# EAGLE design ROV_HAT_sceem (EAGLE 9.2.2)
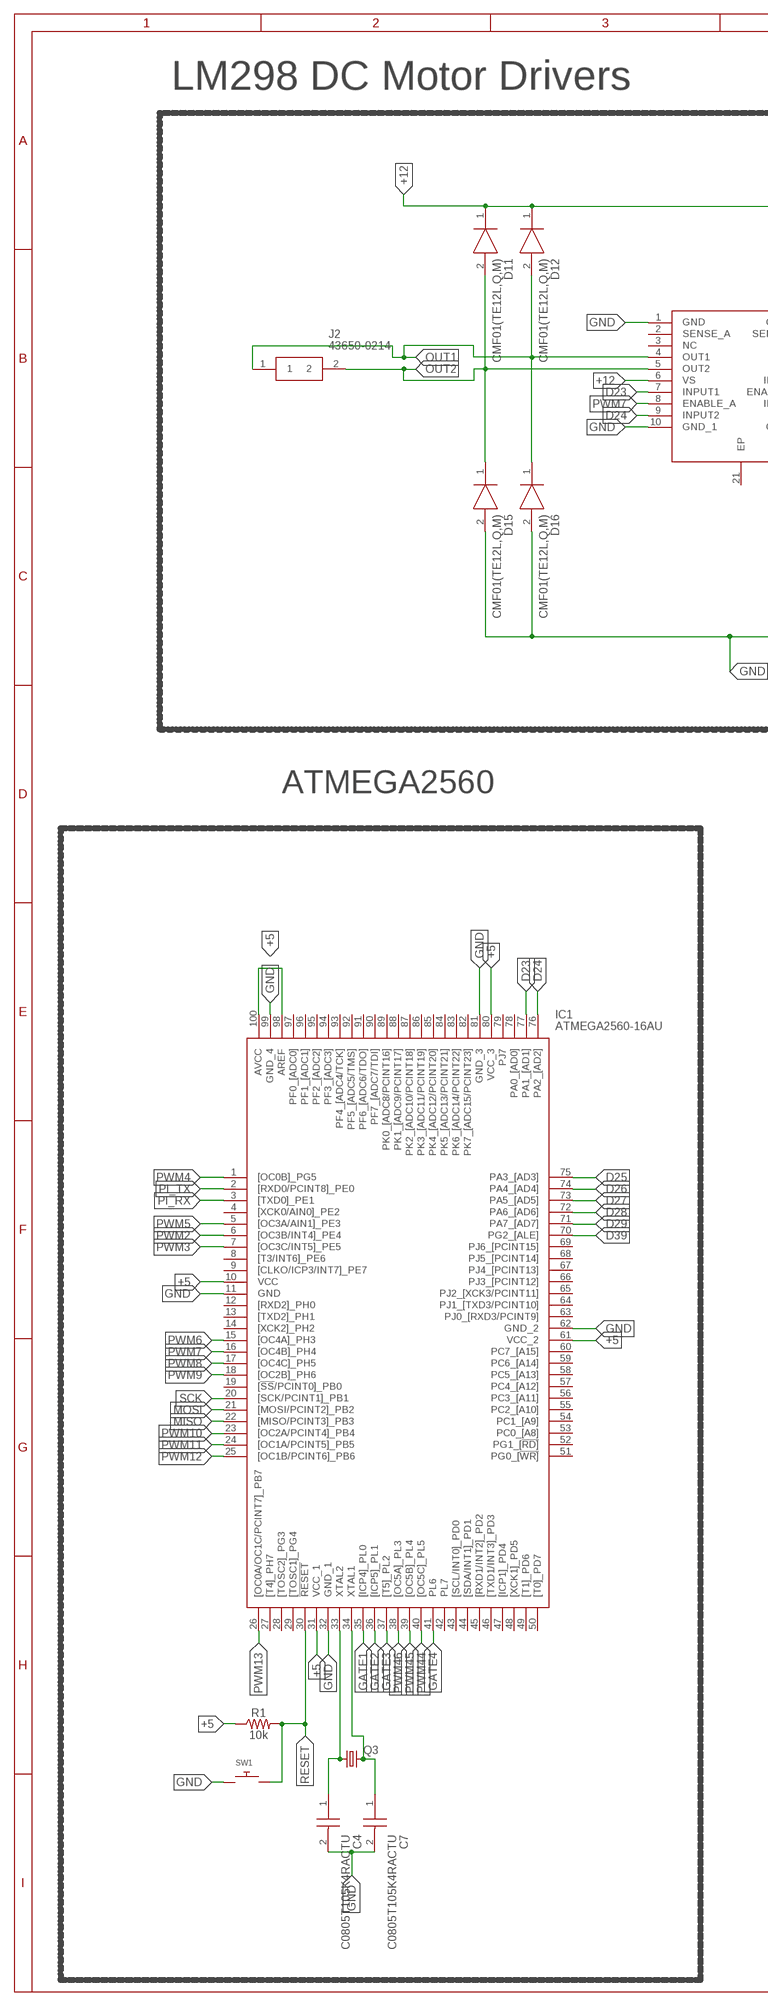
[diagram p0: schematic, sheet 1, part 1 of 2]
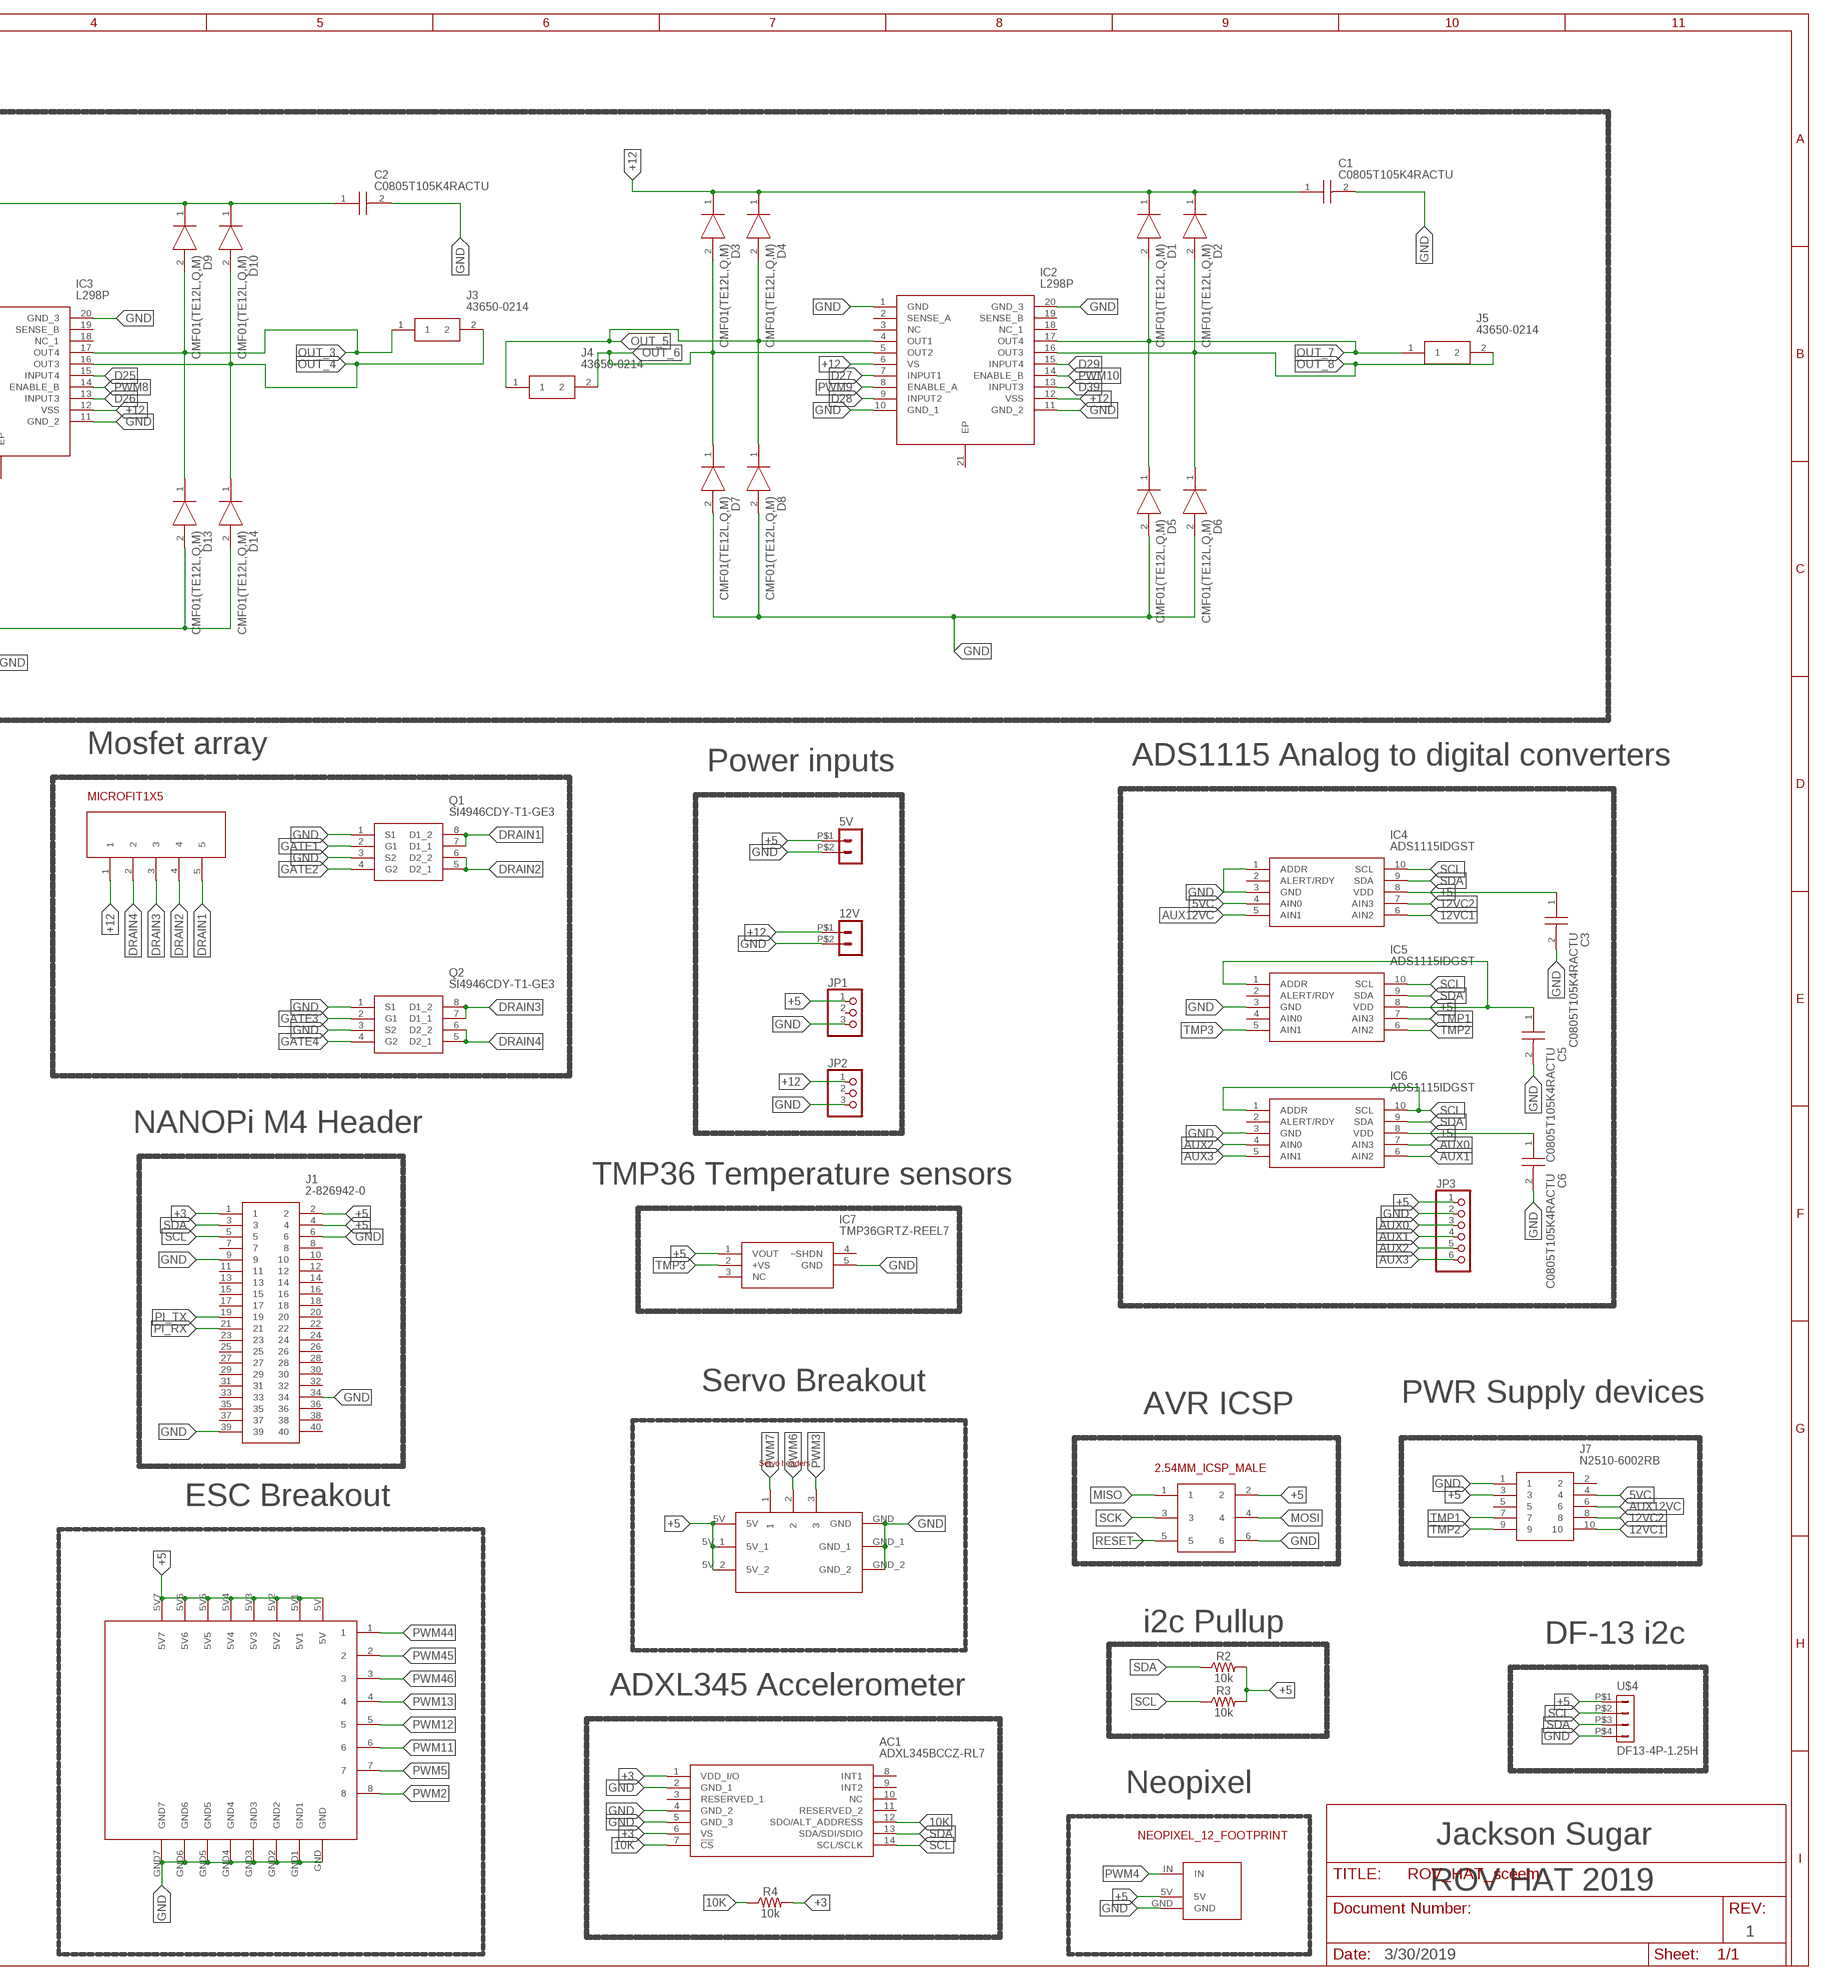
[diagram p1: schematic, sheet 1, part 2 of 2]

## Parts
5V  HEADER_POS2_43045-0200  [43045-0200]
12V  HEADER_POS2_43650-0200  [43650-0200]
AC1  ADXL345BCCZ-RL7  [CC-14-1]
C1  C0805T105K4RACTU  [CAPC2012X100N]
C2  C0805T105K4RACTU  [CAPC2012X100N]
C3  C0805T105K4RACTU  [CAPC2012X100N]
C4  C0805T105K4RACTU  [CAPC2012X100N]
C5  C0805T105K4RACTU  [CAPC2012X100N]
C6  C0805T105K4RACTU  [CAPC2012X100N]
C7  C0805T105K4RACTU  [CAPC2012X100N]
D1  CMF01(TE12L,Q,M)  [SODFL4724X108N]
D2  CMF01(TE12L,Q,M)  [SODFL4724X108N]
D3  CMF01(TE12L,Q,M)  [SODFL4724X108N]
D4  CMF01(TE12L,Q,M)  [SODFL4724X108N]
D5  CMF01(TE12L,Q,M)  [SODFL4724X108N]
D6  CMF01(TE12L,Q,M)  [SODFL4724X108N]
D7  CMF01(TE12L,Q,M)  [SODFL4724X108N]
D8  CMF01(TE12L,Q,M)  [SODFL4724X108N]
D9  CMF01(TE12L,Q,M)  [SODFL4724X108N]
D10  CMF01(TE12L,Q,M)  [SODFL4724X108N]
D11  CMF01(TE12L,Q,M)  [SODFL4724X108N]
D12  CMF01(TE12L,Q,M)  [SODFL4724X108N]
D13  CMF01(TE12L,Q,M)  [SODFL4724X108N]
D14  CMF01(TE12L,Q,M)  [SODFL4724X108N]
D15  CMF01(TE12L,Q,M)  [SODFL4724X108N]
D16  CMF01(TE12L,Q,M)  [SODFL4724X108N]
IC1  ATMEGA2560-16AU  [QFP50P1600X1600X120-100N]
IC2  L298P  [SOIC127P1420X360-21N]
IC3  L298P  [SOIC127P1420X360-21N]
IC4  ADS1115IDGST  [SOP50P490X110-10N]
IC5  ADS1115IDGST  [SOP50P490X110-10N]
IC6  ADS1115IDGST  [SOP50P490X110-10N]
IC7  TMP36GRTZ-REEL7  [SOT95P280X145-5N]
J1  2-826942-0  [HDRV40W63P254_2X20_5080X500X88]
J2  43650-0214  [43650-0214]
J3  43650-0214  [43650-0214]
J4  43650-0214  [43650-0214]
J5  43650-0214  [43650-0214]
J7  N2510-6002RB  [SHDR10W64P254_2X5_2002X859X100]
JP1  PINHD-1X3  [1X03]
JP2  PINHD-1X3  [1X03]
JP3  PINHD-1X6  [1X06]
Q1  SI4946CDY-T1-GE3  [SOIC127P600X175-8N]
Q2  SI4946CDY-T1-GE3  [SOIC127P600X175-8N]
Q3  CRYSTALHC49S  [HC49/S]
R1  10k  10KOHM-0603-1/10W-1%  [0603]
R2  10k  10KOHM-0603-1/10W-1%  [0603]
R3  10k  10KOHM-0603-1/10W-1%  [0603]
R4  10k  10KOHM-0603-1/10W-1%  [0603]
SW1  SWITCH_PUSHBUTTONC&K_KSS  [BTN_CK_KSS]
U$1  3X8_RIGHT_HEADER  [3X8_RIGHT_HEADER]
U$2  2.54MM_ICSP_MALE  [2.54MM_ICSP_MALE]
U$3  NEOPIXEL_12_FOOTPRINT  [NEOPIXEL_12_FOOTPRINT]
U$4  DF13-4P-1.25H  [DF13A-4P-1.25H]
U$5  SERVO_PWM_HEADER  [SERVO_PWM_HEADER]
U$6  MICROFIT1X5  [MICROFIT1X5]

## Nets
5VC: IC4.4(AIN0) J7.4
10K: AC1.7(!CS) AC1.12(SDO/ALT_ADDRESS) R4.1
12VC1: IC4.6(AIN2) J7.10
12VC2: IC4.7(AIN3) J7.8
+3: AC1.1(VDD_I/O) AC1.6(VS) J1.1 R4.2
+5: 5V.P$1 C3.1 C5.1 C6.1 IC1.10(VCC) IC1.31(VCC_1) IC1.61(VCC_2) IC1.80(VCC_3) IC1.98(AREF) IC1.100(AVCC) IC4.8(VDD) IC5.1(ADDR) IC5.8(VDD) IC6.8(VDD) IC7.1(VOUT) J1.2 J1.4 J7.3 JP1.1 JP3.1 R1.1 R2.2 R3.2 U$1.5V U$1.5V1 U$1.5V2 U$1.5V3 U$1.5V4 U$1.5V5 U$1.5V6 U$1.5V7 U$2.2 U$3.5V U$4.P$1 U$5.5V U$5.5V_1 U$5.5V_2
+12: 12V.P$1 C1.1 C2.1 D1.1(K) D2.1(K) D3.1(K) D4.1(K) D9.1(K) D10.1(K) D11.1(K) D12.1(K) IC2.6(VS) IC2.12(VSS) IC3.6(VS) IC3.12(VSS) JP2.1 U$6.1
AUX0: IC6.7(AIN3) JP3.3
AUX1: IC6.6(AIN2) JP3.4
AUX2: IC6.4(AIN0) JP3.5
AUX3: IC6.5(AIN1) JP3.6
AUX12VC: IC4.5(AIN1) J7.6
D23: IC1.77(PA1_[AD1]) IC3.7(INPUT1)
D24: IC1.76(PA2_[AD2]) IC3.9(INPUT2)
D25: IC1.75(PA3_[AD3]) IC3.15(INPUT4)
D26: IC1.74(PA4_[AD4]) IC3.13(INPUT3)
D27: IC1.73(PA5_[AD5]) IC2.7(INPUT1)
D28: IC1.72(PA6_[AD6]) IC2.9(INPUT2)
D29: IC1.71(PA7_[AD7]) IC2.15(INPUT4)
D39: IC1.70(PG2_[ALE]) IC2.13(INPUT3)
DRAIN1: Q1.7(D1_1) Q1.8(D1_2) U$6.5
DRAIN2: Q1.5(D2_1) Q1.6(D2_2) U$6.4
DRAIN3: Q2.7(D1_1) Q2.8(D1_2) U$6.3
DRAIN4: Q2.5(D2_1) Q2.6(D2_2) U$6.2
GATE1: IC1.35([ICP4]_PL0) Q1.2(G1)
GATE2: IC1.36([ICP5]_PL1) Q1.4(G2)
GATE3: IC1.37([T5]_PL2) Q2.2(G1)
GATE4: IC1.41(PL6) Q2.4(G2)
GND: 5V.P$2 12V.P$2 AC1.2(GND_1) AC1.4(GND_2) AC1.5(GND_3) C1.2 C2.2 C3.2 C4.2 C5.2 C6.2 C7.2 D5.2(A) D6.2(A) D7.2(A) D8.2(A) D13.2(A) D14.2(A) D15.2(A) D16.2(A) IC1.11(GND) IC1.32(GND_1) IC1.62(GND_2) IC1.81(GND_3) IC1.99(GND_4) IC2.1(GND) IC2.10(GND_1) IC2.11(GND_2) IC2.20(GND_3) IC3.1(GND) IC3.10(GND_1) IC3.11(GND_2) IC3.20(GND_3) IC4.1(ADDR) IC4.3(GND) IC5.3(GND) IC6.3(GND) IC7.5(GND) J1.6 J1.9 J1.34 J1.39 J7.1 JP1.3 JP2.3 JP3.2 Q1.1(S1) Q1.3(S2) Q2.1(S1) Q2.3(S2) SW1.P$1 U$1.GND U$1.GND1 U$1.GND2 U$1.GND3 U$1.GND4 U$1.GND5 U$1.GND6 U$1.GND7 U$2.6 U$3.GND U$4.P$4 U$5.GND U$5.GND_1 U$5.GND_2
MISO: IC1.22([MISO/PCINT3]_PB3) U$2.1
MOSI: IC1.21([MOSI/PCINT2]_PB2) U$2.4
N$1: C4.1 IC1.33(XTAL2) Q3.1
N$2: C7.1 IC1.34(XTAL1) Q3.2
OUT1: D12.2(A) D16.1(K) IC3.4(OUT1) J2.1
OUT2: D11.2(A) D15.1(K) IC3.5(OUT2) J2.2
OUT_3: D9.2(A) D13.1(K) IC3.17(OUT4) J3.1
OUT_4: D10.2(A) D14.1(K) IC3.16(OUT3) J3.2
OUT_5: D4.2(A) D8.1(K) IC2.4(OUT1) J4.1
OUT_6: D3.2(A) D7.1(K) IC2.5(OUT2) J4.2
OUT_7: D1.2(A) D5.1(K) IC2.17(OUT4) J5.1
OUT_8: D2.2(A) D6.1(K) IC2.16(OUT3) J5.2
PI_RX: IC1.3([TXD0]_PE1) J1.21
PI_TX: IC1.2([RXD0/PCINT8]_PE0) J1.19
PWM2: IC1.6([OC3B/INT4]_PE4) U$1.8
PWM3: IC1.7([OC3C/INT5]_PE5) U$5.3
PWM4: IC1.1([OC0B]_PG5) U$3.IN
PWM5: IC1.5([OC3A/AIN1]_PE3) U$1.7
PWM6: IC1.15([OC4A]_PH3) U$5.2
PWM7: IC1.16([OC4B]_PH4) IC3.8(ENABLE_A) U$5.1
PWM8: IC1.17([OC4C]_PH5) IC3.14(ENABLE_B)
PWM9: IC1.18([OC2B]_PH6) IC2.8(ENABLE_A)
PWM10: IC1.23([OC2A/PCINT4]_PB4) IC2.14(ENABLE_B)
PWM11: IC1.24([OC1A/PCINT5]_PB5) U$1.6
PWM12: IC1.25([OC1B/PCINT6]_PB6) U$1.5
PWM13: IC1.26([OC0A/OC1C/PCINT7]_PB7) U$1.4
PWM44: IC1.40([OC5C]_PL5) U$1.1
PWM45: IC1.39([OC5B]_PL4) U$1.2
PWM46: IC1.38([OC5A]_PL3) U$1.3
RESET: IC1.30(!RESET) R1.2 SW1.P$2 U$2.5
SCK: IC1.20([SCK/PCINT1]_PB1) U$2.3
SCL: AC1.14(SCL/SCLK) IC4.10(SCL) IC5.10(SCL) IC6.1(ADDR) IC6.10(SCL) J1.5 R3.1 U$4.P$2
SDA: AC1.13(SDA/SDI/SDIO) IC4.9(SDA) IC5.9(SDA) IC6.9(SDA) J1.3 R2.1 U$4.P$3
TMP1: IC5.7(AIN3) J7.7
TMP2: IC5.6(AIN2) J7.9
TMP3: IC5.5(AIN1) IC7.2(+VS)
Unconnected: AC1.3(RESERVED_1) AC1.8(INT1) AC1.9(INT2) AC1.10(NC) AC1.11(RESERVED_2) IC1.4([XCK0/AIN0]_PE2) IC1.8([T3/INT6]_PE6) IC1.9([CLKO/ICP3/INT7]_PE7) IC1.12([RXD2]_PH0) IC1.13([TXD2]_PH1) IC1.14([XCK2]_PH2) IC1.19([!SS!/PCINT0]_PB0) IC1.27([T4]_PH7) IC1.28([TOSC2]_PG3) IC1.29([TOSC1]_PG4) IC1.42(PL7) IC1.43([SCL/INT0]_PD0) IC1.44([SDA/INT1]_PD1) IC1.45([RXD1/INT2]_PD2) IC1.46([TXD1/INT3]_PD3) IC1.47([ICP1]_PD4) IC1.48([XCK1]_PD5) IC1.49([T1]_PD6) IC1.50([T0]_PD7) IC1.51(PG0_[!WR]) IC1.52(PG1_[!RD]) IC1.53(PC0_[A8]) IC1.54(PC1_[A9]) IC1.55(PC2_[A10]) IC1.56(PC3_[A11]) IC1.57(PC4_[A12]) IC1.58(PC5_[A13]) IC1.59(PC6_[A14]) IC1.60(PC7_[A15]) IC1.63(PJ0_[RXD3/PCINT9]) IC1.64(PJ1_[TXD3/PCINT10]) IC1.65(PJ2_[XCK3/PCINT11]) IC1.66(PJ3_[PCINT12]) IC1.67(PJ4_[PCINT13]) IC1.68(PJ5_[PCINT14]) IC1.69(PJ6_[PCINT15]) IC1.78(PA0_[AD0]) IC1.79(PJ7) IC1.82(PK7_[ADC15/PCINT23]) IC1.83(PK6_[ADC14/PCINT22]) IC1.84(PK5_[ADC13/PCINT21]) IC1.85(PK4_[ADC12/PCINT20]) IC1.86(PK3_[ADC11/PCINT19]) IC1.87(PK2_[ADC10/PCINT18]) IC1.88(PK1_[ADC9/PCINT17]) IC1.89(PK0_[ADC8/PCINT16]) IC1.90(PF7_[ADC7/TDI]) IC1.91(PF6_[ADC6/TDO]) IC1.92(PF5_[ADC5/TMS]) IC1.93(PF4_[ADC4/TCK]) IC1.94(PF3_[ADC3]) IC1.95(PF2_[ADC2]) IC1.96(PF1_[ADC1]) IC1.97(PF0_[ADC0]) IC2.2(SENSE_A) IC2.3(NC) IC2.18(NC_1) IC2.19(SENSE_B) IC2.21(EP) IC3.2(SENSE_A) IC3.3(NC) IC3.18(NC_1) IC3.19(SENSE_B) IC3.21(EP) IC4.2(ALERT/RDY) IC5.2(ALERT/RDY) IC5.4(AIN0) IC6.2(ALERT/RDY) IC7.3(NC) IC7.4(~SHDN) J1.7 J1.8 J1.10 J1.11 J1.12 J1.13 J1.14 J1.15 J1.16 J1.17 J1.18 J1.20 J1.22 J1.23 J1.24 J1.25 J1.26 J1.27 J1.28 J1.29 J1.30 J1.31 J1.32 J1.33 J1.35 J1.36 J1.37 J1.38 J1.40 J7.2 J7.5 JP1.2 JP2.2

## Notes on the sheet
- LM298 DC Motor Drivers
- Mosfet array
- Power inputs | ADS1115 Analog to digital converters
- ATMEGA2560
- NANOPi M4 Header
- TMP36 Temperature sensors
- Servo Breakout
- PWR Supply devices
- AVR ICSP
- ESC Breakout
- i2c Pullup
- DF-13 i2c
- ADXL345 Accelerometer
- Neopixel
- Jackson Sugar
- ROV HAT 2019
- 1
- 3/30/2019

## Library data of the parts
5V 12V = con-molex-micro-fit-3_0:HEADER_POS2_?: Molex - Micro-Fit 3.0 Series connector, 3.00mm (0.118") pitch header, 2 positions.
AC1 = SamacSys_Parts:ADXL345BCCZ-RL7: ADXL345BCCZ-RL7 Analog Devices, 3-Axis Accelerometer, I2C, SPI, 14-Pin LGA Source: Datasheet <https://componentsearchengine.com/Datasheets/1/ADXL345BCCZ-RL7.pdf>; DESCRIPTION: ADXL345BCCZ-RL7 Analog Devices, 3-Axis Accelerometer, I2C, SPI, 14-Pin LGA; HEIGHT: mm; MANUFACTURER_NAME: Analog Devices; MANUFACTURER_PART_NUMBER: ADXL345BCCZ-RL7; MOUSER_PART_NUMBER: 584-ADXL345BCCZ-R7
C1-C7 = SamacSys_Parts:C0805T105K4RACTU: KEMET - C0805T105K4RACTU - CAP, 1F, 16V, 10%, X7R, 0805 Source: Datasheet <https://componentsearchengine.com/Datasheets/1/C0805T105K4RACTU.pdf>; DESCRIPTION: KEMET - C0805T105K4RACTU - CAP, 1F, 16V, 10%, X7R, 0805; HEIGHT: 1mm; MANUFACTURER_NAME: Kemet; MANUFACTURER_PART_NUMBER: C0805T105K4RACTU; MOUSER_PART_NUMBER: 80-C0805T105K4RACTU
D1-D16 = SamacSys_Parts:CMF01(TE12L,Q,M): Diodes - General Purpose, Power, Switching 600V 2A M-FLAT Source: Datasheet <https://componentsearchengine.com/Datasheets/1/CMF01(TE12L,Q,M).pdf>; DESCRIPTION: Diodes - General Purpose, Power, Switching 600V 2A M-FLAT; HEIGHT: 1.08mm; MANUFACTURER_NAME: Toshiba; MANUFACTURER_PART_NUMBER: CMF01(TE12L,Q,M); MOUSER_PART_NUMBER: 757-CMF01TE12LQM
IC1 = SamacSys_Parts:ATMEGA2560-16AU: ATMEGA2560-16AU, 8 bit AVR Microcontroller 16MHz 4, 256kb Flash, 8kb RAM, I2C SPI 100-Pin TQFP Source: Datasheet <https://componentsearchengine.com/Datasheets/1/ATMEGA2560-16AU.pdf>; DESCRIPTION: ATMEGA2560-16AU, 8 bit AVR Microcontroller 16MHz 4, 256kb Flash, 8kb RAM, I2C SPI 100-Pin TQFP; HEIGHT: 1.2mm; MANUFACTURER_NAME: Microchip; MANUFACTURER_PART_NUMBER: ATMEGA2560-16AU; MOUSER_PART_NUMBER: 556-ATMEGA2560-16AU
IC2 IC3 = SamacSys_Parts:L298P: L298P, Full Bridge Motor Driver, 3A Dual Full Bridge Motor Driver,, 25W 4.8 46 V, 20-Pin Power SO Source: Datasheet <http://www.mouser.com/datasheet/2/389/l298-954744.pdf>; DESCRIPTION: L298P, Full Bridge Motor Driver, 3A Dual Full Bridge Motor Driver,, 25W 4.8 46 V, 20-Pin Power SO; HEIGHT: 3.6mm; MANUFACTURER_NAME: STMicroelectronics; MANUFACTURER_PART_NUMBER: L298P; MOUSER_PART_NUMBER: 511-L298P
IC4-IC6 = SamacSys_Parts:ADS1115IDGST: 16-Bit, 860SPS, 4-Ch Delta-Sigma ADC w/ PGA, Oscillator, Voltage Reference, Comparator & I2C Source: Datasheet; DESCRIPTION: 16-Bit, 860SPS, 4-Ch Delta-Sigma ADC w/ PGA, Oscillator, Voltage Reference, Comparator & I2C; HEIGHT: 1.1mm; MANUFACTURER_NAME: Texas Instruments; MANUFACTURER_PART_NUMBER: ADS1115IDGST; MOUSER_PART_NUMBER: 595-ADS1115IDGST
IC7 = SamacSys_Parts:TMP36GRTZ-REEL7: Analog Devices TMP36GRTZ-REEL7 Temperature Sensor 5-Pin SOT-23, -40 +125 C Source: Datasheet <https://componentsearchengine.com/Datasheets/1/TMP36GRTZ-REEL7.pdf>; DESCRIPTION: Analog Devices TMP36GRTZ-REEL7 Temperature Sensor 5-Pin SOT-23, -40 +125 C; HEIGHT: mm; MANUFACTURER_NAME: Analog Devices; MANUFACTURER_PART_NUMBER: TMP36GRTZ-REEL7; MOUSER_PART_NUMBER: 584-TMP36GRTZ-R7
J1 = SamacSys_Parts:2-826942-0: 2x20 straight pin header tin Mod II Source: Datasheet <https://componentsearchengine.com/Datasheets/1/2-826942-0.pdf>; DESCRIPTION: 2x20 straight pin header tin Mod II; HEIGHT: 8.8mm; MANUFACTURER_NAME: TE Connectivity; MANUFACTURER_PART_NUMBER: 2-826942-0; MOUSER_PART_NUMBER: 571-2-826942-0
J2-J5 = SamacSys_Parts:43650-0214: Molex MICRO-FIT 3.0 Series, Series Number 43650, 3mm Pitch 2 Way 1 Row Right Angle PCB Header, Solder Termination, 5A Source: Datasheet <http://www.mouser.com/datasheet/2/276/0436500214_PCB_HEADERS-693580.pdf>; DESCRIPTION: Molex MICRO-FIT 3.0 Series, Series Number 43650, 3mm Pitch 2 Way 1 Row Right Angle PCB Header, Solder Termination, 5A; HEIGHT: mm; MANUFACTURER_NAME: Molex; MANUFACTURER_PART_NUMBER: 43650-0214; MOUSER_PART_NUMBER: 538-43650-0214
J7 = SamacSys_Parts:N2510-6002RB: 3M 10W ST BOX HDR CLASS 2 3M 2500 Series, 2.54mm Pitch 10 Way 2 Row Straight PCB Header, Solder Termination, 2A Source: Datasheet <https://componentsearchengine.com/Datasheets/1/N2510-6002RB.pdf>; DESCRIPTION: 3M 10W ST BOX HDR CLASS 2 3M 2500 Series, 2.54mm Pitch 10 Way 2 Row Straight PCB Header, Solder Termination, 2A; HEIGHT: 10.04mm; MANUFACTURER_NAME: 3M; MANUFACTURER_PART_NUMBER: N2510-6002RB; MOUSER_PART_NUMBER: 517-N2510-6002RB
JP1 JP2 = adafruit:PINHD-1X3: PIN HEADER
JP3 = adafruit:PINHD-1X6: PIN HEADER
Q1 Q2 = SamacSys_Parts:SI4946CDY-T1-GE3: VISHAY - SI4946CDY-T1-GE3 - MOSFET, DUAL N-CH, 60V, SOIC Source: Datasheet <https://componentsearchengine.com/Datasheets/1/SI4946CDY-T1-GE3.pdf>; DESCRIPTION: VISHAY - SI4946CDY-T1-GE3 - MOSFET, DUAL N-CH, 60V, SOIC; HEIGHT: 1.75mm; MANUFACTURER_NAME: Vishay; MANUFACTURER_PART_NUMBER: SI4946CDY-T1-GE3; MOUSER_PART_NUMBER: 78-SI4946CDY-T1-GE3
Q3 = adafruit:CRYSTAL: CRYSTAL; OC_FARNELL: 1667008; OC_NEWARK: unknown
R1-R4 = SparkFun-Resistors:10KOHM: 10kΩ resistor A resistor is a passive two-terminal electrical component that implements electrical resistance as a circuit element. Resistors act to reduce current flow, and, at the same time, act to lower voltage levels within circuits. - Wikipedia; PROD_ID: RES-00824
SW1 = adafruit:SWITCH_PUSHBUTTON: Buttons SOFTTOUCHSMD_SJ - Soft touch temporary push button (Super Junk Akihabara) Compatible with SKPMANE010 [Mouser: 688-SKPMAN] C&K_KSS = Digikey: KSS221GLFS
U$1 = 3X8_RIGHT_HEADER:3X8_RIGHT_HEADER
U$2 = 2.54mm_ICSP_MALE_SMD:2.54MM_ICSP_MALE
U$3 = NEOPIXEL_12_FOOTPRINT:NEOPIXEL_12_FOOTPRINT
U$4 = con-hirose-df13:DF13-4P-1.25: DF13-4P 1.25mm Pitch Miniature Crimping Connector.
U$5 = servo_pwm_header:SERVO_PWM_HEADER
U$6 = MICROFIT1X5:MICROFIT1X5

## Board
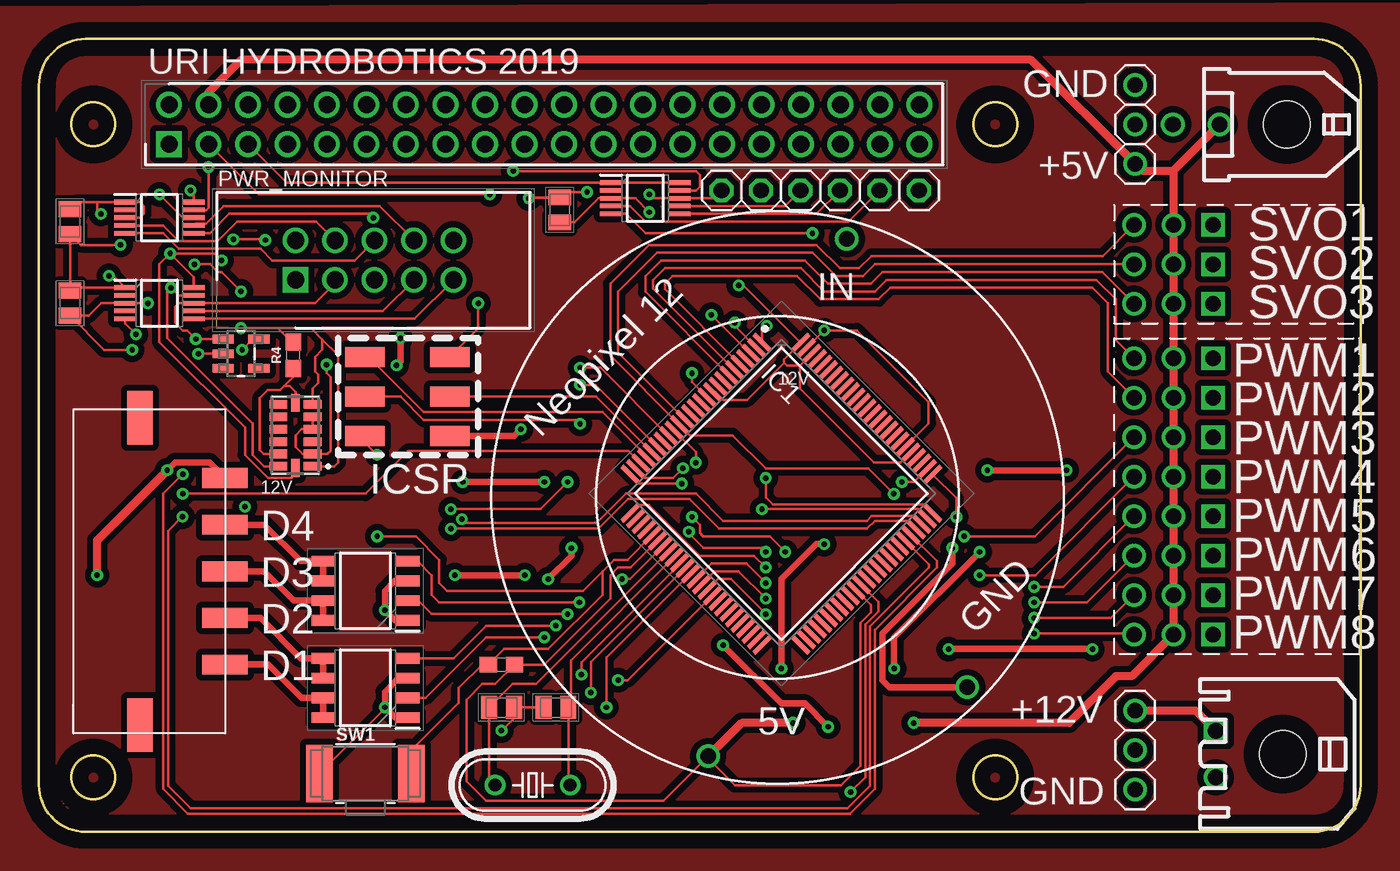
[diagram p2: board, top side]
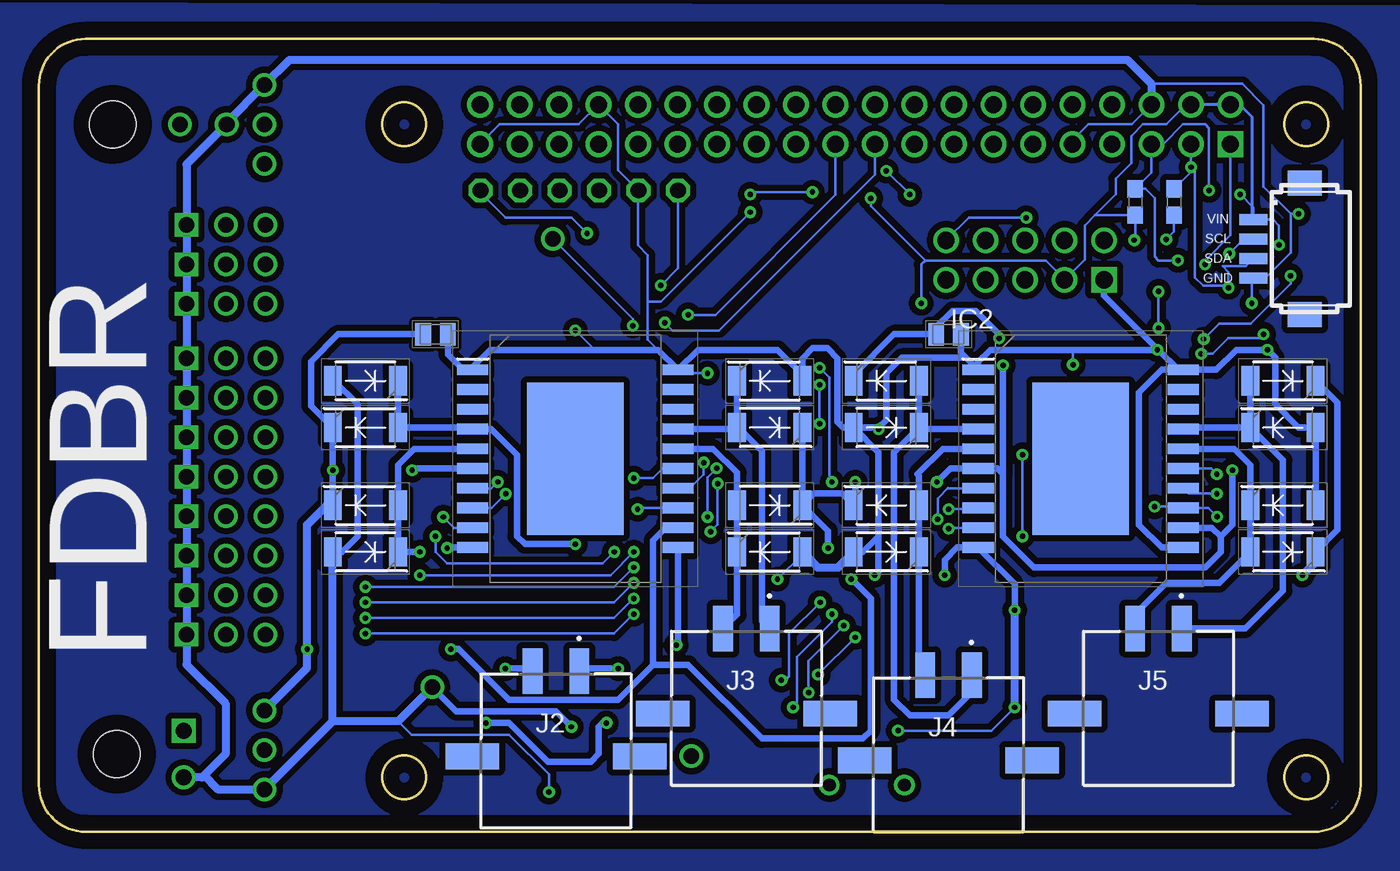
[diagram p3: board, bottom side, seen from below]

Size 85 x 51 mm. Coordinates in mm from the lower left corner, seen from the top.
Outline: 0,3 0,48 arc-90 3,51 82,51 arc-90 85,48 85,3 arc-90 82,0 3,0 arc-90 0,3
Outline: circle at 3.5,45.5 radius 1.4
Outline: circle at 3.5,3.5 radius 1.4
Outline: circle at 61.5,45.5 radius 1.4
Outline: circle at 61.5,3.5 radius 1.4
Copper layers (1*16): Top 0.035mm / dielectric 1.5mm / Bottom 0.035mm
Design rules "default": minimum track width 6mil, minimum drill 0.35mm, track to track 6mil, track to pad 6mil, pad to pad 6mil, via to via 6mil, smd to smd 6mil, copper to edge 40mil, drill to drill 6mil, minimum pad ring 10mil, minimum via ring 8mil, stop-mask expansion 4mil, vias tented up to drill 0mil, thermal gap 10mil

### Footprints (pad centres in the part's own frame; a part is rotated, then mirrored left to right if it is on the bottom)
43045-0200 = drill 1.02: P$1 0,4.32; P$2 0,7.32 | hole 3: 0,0
43650-0200 = drill 1.02 square: P$1 1.5,4.32 | drill 1.02: P$2 -1.5,4.32 | hole 3: 0,0
CC-14-1 = smd 1.145 x 0.55: 1 -1.097,2; 2 -1.097,1.2; 3 -1.097,0.4; 4 -1.097,-0.4; 5 -1.097,-1.2; 6 -1.097,-2; 8 1.097,-2; 9 1.097,-1.2; 10 1.097,-0.4; 11 1.097,0.4; 12 1.097,1.2; 13 1.097,2 | smd 0.55 x 1.145: 7 0,-2.098; 14 0,2.098
CAPC2012X100N = smd 1.02 x 1.47: 1 -0.8,0; 2 0.8,0
SODFL4724X108N = smd 1.14 x 1.89: 1 -2.1,0; 2 2.1,0
QFP50P1600X1600X120-100N = smd 1.5 x 0.3: 1 -7.75,6; 2 -7.75,5.5; 3 -7.75,5; 4 -7.75,4.5; 5 -7.75,4; 6 -7.75,3.5; 7 -7.75,3; 8 -7.75,2.5; 9 -7.75,2; 10 -7.75,1.5; 11 -7.75,1; 12 -7.75,0.5; 13 -7.75,0; 14 -7.75,-0.5; 15 -7.75,-1; 16 -7.75,-1.5; 17 -7.75,-2; 18 -7.75,-2.5; 19 -7.75,-3; 20 -7.75,-3.5; 21 -7.75,-4; 22 -7.75,-4.5; 23 -7.75,-5; 24 -7.75,-5.5; 25 -7.75,-6; 51 7.75,-6; 52 7.75,-5.5; 53 7.75,-5; 54 7.75,-4.5; 55 7.75,-4; 56 7.75,-3.5; 57 7.75,-3; 58 7.75,-2.5; 59 7.75,-2; 60 7.75,-1.5; 61 7.75,-1; 62 7.75,-0.5; 63 7.75,0; 64 7.75,0.5; 65 7.75,1; 66 7.75,1.5; 67 7.75,2; 68 7.75,2.5; 69 7.75,3; 70 7.75,3.5; 71 7.75,4; 72 7.75,4.5; 73 7.75,5; 74 7.75,5.5; 75 7.75,6 | smd 0.3 x 1.5: 26 -6,-7.75; 27 -5.5,-7.75; 28 -5,-7.75; 29 -4.5,-7.75; 30 -4,-7.75; 31 -3.5,-7.75; 32 -3,-7.75; 33 -2.5,-7.75; 34 -2,-7.75; 35 -1.5,-7.75; 36 -1,-7.75; 37 -0.5,-7.75; 38 0,-7.75; 39 0.5,-7.75; 40 1,-7.75; 41 1.5,-7.75; 42 2,-7.75; 43 2.5,-7.75; 44 3,-7.75; 45 3.5,-7.75; 46 4,-7.75; 47 4.5,-7.75; 48 5,-7.75; 49 5.5,-7.75; 50 6,-7.75; 76 6,7.75; 77 5.5,7.75; 78 5,7.75; 79 4.5,7.75; 80 4,7.75; 81 3.5,7.75; 82 3,7.75; 83 2.5,7.75; 84 2,7.75; 85 1.5,7.75; 86 1,7.75; 87 0.5,7.75; 88 0,7.75; 89 -0.5,7.75; 90 -1,7.75; 91 -1.5,7.75; 92 -2,7.75; 93 -2.5,7.75; 94 -3,7.75; 95 -3.5,7.75; 96 -4,7.75; 97 -4.5,7.75; 98 -5,7.75; 99 -5.5,7.75; 100 -6,7.75
SOIC127P1420X360-21N = smd 2 x 0.7: 1 -6.6,5.715; 2 -6.6,4.445; 3 -6.6,3.175; 4 -6.6,1.905; 5 -6.6,0.635; 6 -6.6,-0.635; 7 -6.6,-1.905; 8 -6.6,-3.175; 9 -6.6,-4.445; 10 -6.6,-5.715; 11 6.6,-5.715; 12 6.6,-4.445; 13 6.6,-3.175; 14 6.6,-1.905; 15 6.6,-0.635; 16 6.6,0.635; 17 6.6,1.905; 18 6.6,3.175; 19 6.6,4.445; 20 6.6,5.715 | smd 6.2 x 9.8: 21 0,0
SOP50P490X110-10N = smd 1.4 x 0.3: 1 -2.2,1; 2 -2.2,0.5; 3 -2.2,0; 4 -2.2,-0.5; 5 -2.2,-1; 6 2.2,-1; 7 2.2,-0.5; 8 2.2,0; 9 2.2,0.5; 10 2.2,1
SOT95P280X145-5N = smd 1.372 x 0.559: 1 -1.143,0.94; 2 -1.143,0; 3 -1.143,-0.94; 4 1.143,-0.94; 5 1.143,0.94
HDRV40W63P254_2X20_5080X500X88 = drill 1.1 pad 1.65 square: 1 -24.13,-1.27 | drill 1.1 pad 1.65: 2 -24.13,1.27; 3 -21.59,-1.27; 4 -21.59,1.27; 5 -19.05,-1.27; 6 -19.05,1.27; 7 -16.51,-1.27; 8 -16.51,1.27; 9 -13.97,-1.27; 10 -13.97,1.27; 11 -11.43,-1.27; 12 -11.43,1.27; 13 -8.89,-1.27; 14 -8.89,1.27; 15 -6.35,-1.27; 16 -6.35,1.27; 17 -3.81,-1.27; 18 -3.81,1.27; 19 -1.27,-1.27; 20 -1.27,1.27; 21 1.27,-1.27; 22 1.27,1.27; 23 3.81,-1.27; 24 3.81,1.27; 25 6.35,-1.27; 26 6.35,1.27; 27 8.89,-1.27; 28 8.89,1.27; 29 11.43,-1.27; 30 11.43,1.27; 31 13.97,-1.27; 32 13.97,1.27; 33 16.51,-1.27; 34 16.51,1.27; 35 19.05,-1.27; 36 19.05,1.27; 37 21.59,-1.27; 38 21.59,1.27; 39 24.13,-1.27; 40 24.13,1.27
43650-0214 = smd 1.27 x 2.92: 1 1.5,10.07; 2 -1.5,10.07 | smd 3.43 x 1.65: 3 -5.385,4.6; 4 5.385,4.6
SHDR10W64P254_2X5_2002X859X100 = drill 1.1 pad 1.65 square: 1 0,0 | drill 1.1 pad 1.65: 2 0,2.54; 3 2.54,0; 4 2.54,2.54; 5 5.08,0; 6 5.08,2.54; 7 7.62,0; 8 7.62,2.54; 9 10.16,0; 10 10.16,2.54
1X03 = drill 1.016: 1 -2.54,0; 2 0,0; 3 2.54,0
1X06 = drill 1.016 octagon: 1 -6.35,0; 2 -3.81,0; 3 -1.27,0; 4 1.27,0; 5 3.81,0; 6 6.35,0
SOIC127P600X175-8N = smd 1.525 x 0.7: 1 -2.712,1.905; 2 -2.712,0.635; 3 -2.712,-0.635; 4 -2.712,-1.905; 5 2.712,-1.905; 6 2.712,-0.635; 7 2.712,0.635; 8 2.712,1.905
HC49/S = drill 0.813: 1 -2.413,0; 2 2.413,0
0603 = smd 1.1 x 1: 1 -0.85,0; 2 0.85,0
BTN_CK_KSS = smd 1.7 x 3.7: P$1 -2.95,0; P$2 2.95,0
3X8_RIGHT_HEADER = drill 1: 1 5.08,20.32; 2 5.08,17.78; 3 5.08,15.24; 4 5.08,12.7; 5 5.08,10.16; 5V 2.54,20.32; 5V1 2.54,17.78; 5V2 2.54,15.24; 5V3 2.54,12.7; 5V4 2.54,10.16; 5V5 2.54,7.62; 5V6 2.54,5.08; 5V7 2.54,2.54; 6 5.08,7.62; 7 5.08,5.08; 8 5.08,2.54 | drill 1 square: GND 0,20.32; GND1 0,17.78; GND2 0,15.24; GND3 0,12.7; GND4 0,10.16; GND5 0,7.62; GND6 0,5.08; GND7 0,2.54
2.54MM_ICSP_MALE = smd 2.54 x 1.27: 1 -2.54,2.54; 2 2.92,2.54; 3 -2.54,0; 4 2.92,0; 5 -2.54,-2.54; 6 2.92,-2.54
NEOPIXEL_12_FOOTPRINT = drill 1: 5V -4.457,-16.641; GND 12.207,-12.208; IN 4.459,16.638
DF13A-4P-1.25H = smd 1.6 x 2.2: M$0 -4.225,2.4; M$1 4.225,2.4 | smd 0.7 x 1.8: P$1 -1.875,-0.9; P$2 -0.625,-0.9; P$3 0.625,-0.9; P$4 1.875,-0.9
SERVO_PWM_HEADER = drill 1: 1 -2.54,-5.08; 2 0,-5.08; 3 2.54,-5.08; 5V -2.54,-2.54; 5V_1 0,-2.54; 5V_2 2.54,-2.54 | drill 1 square: GND -2.54,0; GND_1 0,0; GND_2 2.54,0
MICROFIT1X5 = smd 1.27 x 2.921: 1 -6.007,5.474; 2 -2.997,5.474; 3 0,5.474; 4 2.997,5.474; 5 5.994,5.474 | smd 3.429 x 1.651: P$1 9.881,0; P$2 -9.881,0

### Placement (x,y rotation side)
5V  80.25,45.5 90 top
12V  80,5 90 top
AC1  16.5,25.5 180 top
C1  26.5,32 0 bottom
C2  59.5,32 0 bottom
C3  2,39.25 90 top
C4  29.75,8 0 top
C5  2,34 270 top
C6  33.5,40 270 top
C7  33.25,8 180 top
D1  5,29 180 bottom
D2  5,18 180 bottom
D3  30.5,21 0 bottom
D4  30.5,29 0 bottom
D5  5,26 0 bottom
D6  5,21 0 bottom
D7  30.5,18 180 bottom
D8  30.5,26 180 bottom
D9  38,26 180 bottom
D10  38,21 180 bottom
D11  64,21 0 bottom
D12  64,26 0 bottom
D13  38,29 0 bottom
D14  38,18 0 bottom
D15  64,18 180 bottom
D16  64,29 180 bottom
IC1  47.75,21.75 315 top
IC2  18,24 0 bottom
IC3  50.5,24 0 bottom
IC4  7.75,39.5 0 top
IC5  7.75,34 0 top
IC6  39,40.75 0 top
IC7  13,30.75 0 top
J1  32.5,45.5 0 top
J2  51.75,0.25 0 bottom
J3  39.5,3 0 bottom
J4  26.5,0 0 bottom
J5  13,3 0 bottom
J7  16.5,35.5 0 top
JP1  70.5,45.5 90 top
JP2  70.5,5.25 270 top
JP3  50.25,41.25 0 top
Q1  21,9.25 180 top
Q2  21,15.5 180 top
Q3  31.75,3 0 top
R1  29.75,10.75 180 top
R2  12,40.5 270 bottom
R3  14.5,40.5 270 bottom
R4  16.36,30.64 90 top
SW1  21,3.75 0 top
U$1  75.5,33 180 top
U$2  23.5,28 0 top
U$3  47.5,21.5 0 top
U$4  6,37.5 270 bottom
U$5  75.5,36.5 270 top
U$6  6.5,16.75 270 top

### Tracks (layer width: path | path; a pad name or v marks a point on that pad's centre or on a via)
5VC
  Top 0.152: IC4.4 8,39 9,38 11.5,38 12.75,39.25 17.83,39.25 J7.4
10K
  Top 0.152: AC1.12 14.45,24.3 14.2,24.55 14.2,27.9 14.7,28.4 15.5,28.4 15.76,28.66 | 15.76,28.66 16.36,29.26 R4.1 | AC1.7 16.5,28.3 16.14,28.66 15.76,28.66
12VC1  (via drill 0.35)
  Top 0.152: IC4.6 11,38.5 12.25,39.75 21.25,39.75 v21.5,39.5
  Bottom 0.152: v21.5,39.5 25.2,39.5 J7.10
12VC2
  Top 0.152: IC4.7 10.07,39.12 10.75,39.12 11.87,40.25 21.91,40.25 J7.8
+3  (via drill 0.35)
  Top 0.152: AC1.1 19,23.5 19.25,23.75 19.25,30.65 18.22,31.67 | v10,36.5 11,36.5 11.5,36 11.75,36 v13,34.75 | v13,32.39 15.35,32.39 | 15.35,32.39 17.51,32.39 18.22,31.67 | R4.2 16.26,31.49 15.35,32.39 | AC1.6 17.6,28.5 17.95,28.85 17.95,29.4 17.75,29.6 17.75,30.55 18.22,31.02 18.22,31.67
  Bottom 0.152: J1.1 8.37,38.38 10,36.75 v10,36.5 | v13,34.75 v13,32.39
+5  (via drill 0.35)
  Top 0.152: IC1.31 38.05,17 37.25,17 36.75,16.5 36.75,15 32.5,10.75 R1.1 29.35,9.5 28.5,9.5 27.5,8.5 27.5,3.25 28.75,2 40.18,2 42.97,4.78 | v5.25,37.75 2.7,37.75 C3.1 C5.1 2.2,35 IC5.1 4.8,35.75 v4.5,35.75 | IC4.8 9.25,39.5 v7.75,41 | J7.3 19.04,35.29 17.75,34 IC5.8 9,34 8.75,33.75 8.75,32.75 9.25,32.25 9.53,32.25 v10.09,31.69 IC7.1 | JP3.1 43.4,40.75 IC6.8 39.5,40.75 v39.25,41 | v35.25,41.14 33.84,41.14 C6.1 31.55,40.8 v31.5,40.75 | 47.9,30.15 47.9,30.38 IC1.100 45.32,35.14 v45,35.14 | 48.93,30 48.1,30 47.93,30.17 47.9,30.15 | 48.93,30 IC1.98 | v28.25,34 28.25,32.37 U$2.2 | IC1.61 53.5,14.59 53.5,14.11 52.84,13.45 52.84,4.25 51.59,3 44.75,3 42.97,4.78 | IC1.80 55.41,23.75 53.7,23.75 48.93,28.52 48.93,30 | v12.5,38.11 14.5,38.11 v14.55,38.05 | 42.97,4.78 U$3.5V | IC1.10 43.5,28.29 44.01,27.78 45.53,27.78 47.9,30.15 | 42.97,4.78
  Top 0.508: 5V.P$1 72.96,42.53 | 72.96,42.53 U$5.5V U$5.5V_1 U$5.5V_2 U$1.5V7 U$1.5V6 U$1.5V5 U$1.5V4 U$1.5V3 U$1.5V2 U$1.5V1 U$1.5V 70.28,10 69.25,10 66.25,7 v56.25,7 | 72.96,42.53 70.93,42.53 JP1.1 63.81,49.65 13,49.65 10.91,47.56 J1.4 | v48.5,7 45.18,7 42.97,4.78
  Bottom 0.152: 17.1,39.65 17.75,39 17.75,36.79 J7.3 19.04,35.54 20.25,36.75 28,36.75 | 17.1,39.65 R3.2 14.5,38.11 v14.55,38.05 | v5.25,37.75 5.25,39 5.62,39.38 U$4.P$1 6.9,40.15 v7.75,41 | J1.4 11.23,46.77 12.5,45.5 14,45.5 14.75,44.75 14.75,43 15.75,42 15.75,41 17.1,39.65 | v39.25,41 39.11,41.14 v35.25,41.14 | 28,36.75 31.5,40.25 v31.5,40.75 | 28,36.75 28.25,36.5 v28.25,34 | v45,35.14 43.9,36.24 JP3.1 | R2.2 12,38.61 v12.5,38.11 | v4.5,35.75 4.5,35.25 7.06,32.69 9.09,32.69 v10.09,31.69
  Bottom 0.2: U$4.P$1 7,39.48 7,46 7.77,46.77 J1.2 J1.4
  Bottom 0.406: v56.25,7 54.75,7 52.25,4.5 49.5,4.5 49,5 49,6.75 48.75,7 v48.5,7
+12  (via drill 0.35)
  Top 0.406: U$6.1 10.97,23.76 8.76,23.76 v8.25,23.25 | v61,23.25 v66.1,23.25 | v27.25,22.5 v32.5,22.5 | v58.5,11.75 v67.75,11.75 | v23.25,31.75 23.25,30.25 v23,30 | v34.25,18.25 34.25,17.75 v32.75,16.25
  Top 0.508: 12V.P$1 74.39,7.79 JP2.1 | v8.25,23.25 3.75,18.75 v3.75,16.5
  Bottom 0.406: D2.1 1.5,19.4 1.5,27.6 D1.1 | IC2.12 9.56,19.55 9,19 | 9,19 9,18 10,17 21,17 23,19 23,23 | 23,23 23.36,23.37 IC2.6 26.39,23.37 v27.25,22.5 | D10.1 35.15,21.75 33.35,21.75 D3.1 32.5,21.1 v32.5,22.5 | D10.1 D9.1 | D11.1 v66.1,23.25 D12.1 67.5,27.4 67.5,30.25 65.75,32 C2.1 | D4.1 32.6,29.4 30,32 C1.1 27.3,32.45 26.25,33.5 24.75,33.5 23.25,32 v23.25,31.75 | v8.25,23.25 8.25,19.75 9,19 | IC3.6 60.88,23.37 v61,23.25 | IC3.12 44.69,19.55 45.5,18.75 45.5,10.75 | v58.5,11.75 58,11.75 54.75,8.5 47.75,8.5 45.5,10.75 | v23,30 23,23 | D10.1 34.25,19.35 v34.25,18.25 | v32.75,16.25 31.5,15 31.5,6.5 32,6 38.5,6 43.25,10.75 45.5,10.75
  Bottom 0.508: JP2.1 67.75,10.54 v67.75,11.75 67.75,19.75 66.5,21 D11.1 | D2.1 2.9,17.35 v3.75,16.5
AUX0
  Top 0.152: IC6.7 47.98,40.25 JP3.3
AUX1
  Top 0.152: IC6.6 50.02,39.75 JP3.4
AUX2
  Top 0.152: IC6.4 38,40.25 39,39.25 52.06,39.25 JP3.5
AUX3  (via drill 0.35)
  Top 0.152: IC6.5 37.75,39.75 39,38.5 v49.75,38.5
  Bottom 0.152: v49.75,38.5 50.75,39.5 55,39.5 56.6,41.1 JP3.6
AUX12VC
  Top 0.152: IC4.5 8,38.5 9,37.5 14.25,37.5 15,36.75 20.29,36.75 J7.6
D23  (via drill 0.35)
  Top 0.152: v55.5,22.5 56.28,22.5 IC1.77
  Bottom 0.152: IC3.7 55.91,22.09 v55.5,22.5
D24  (via drill 0.35)
  Top 0.152: v59,20.25 59,21.46 IC1.76
  Bottom 0.152: IC3.9 58.31,19.55 v59,20.25
D25  (via drill 0.35)
  Top 0.152: v46.75,22.75 46.75,21.5 47.19,21.05 56.93,21.05 IC1.75
  Bottom 0.152: IC3.15 44.88,23.37 45.5,22.75 v46.75,22.75
D26  (via drill 0.35)
  Top 0.152: IC1.74 56.53,20.75 v46.5,20.75
  Bottom 0.152: IC3.13 46.43,20.83 v46.5,20.75
D27  (via drill 0.35)
  Top 0.152: IC1.73 56.25,20.32 55.89,20.32 55.88,20.3 53.56,20.3 53.25,20 44,20 42.25,21.75 37.75,21.75 35.85,19.85 27.46,19.85 v27.2,20.11
  Bottom 0.152: v27.2,20.11 27.2,21.45 26.55,22.1 26.55,22.09 IC2.7
D28  (via drill 0.35)
  Top 0.152: v26.5,19.5 36,19.5 37.9,21.4 41.85,21.4 43.75,19.5 53.25,19.5 53.75,20 55.86,20 IC1.72
  Bottom 0.152: IC2.9 26.44,19.55 v26.5,19.5
D29  (via drill 0.35)
  Top 0.152: IC1.71 57.75,17.41 57.75,17 53.75,13 53.75,2.75 52.17,1.17 9.58,1.17 8,2.75 8,21.75 v9.25,23
  Bottom 0.152: v9.25,23 9.61,23.37 IC2.15
D39  (via drill 0.35)
  Top 0.152: IC1.70 57.25,17.2 57.25,17 53.44,13.2 53.44,2.95 52,1.5 9.75,1.5 8.31,2.95 8.31,19.34 v9.23,20.27
  Bottom 0.152: v13.25,20.91 11.49,20.91 IC2.13 9.79,20.83 v9.23,20.27
DRAIN1
  Top 0.406: Q1.8 Q1.7 16.89,8.61 14.74,10.76 U$6.5
DRAIN2
  Top 0.406: Q1.6 Q1.5 16.84,11.16 14.25,13.75 U$6.4
DRAIN3
  Top 0.406: Q2.8 Q2.7 16.39,14.86 14.5,16.75 U$6.3
DRAIN4
  Top 0.406: Q2.6 Q2.5 16.84,17.41 14.5,19.75 U$6.2
GATE1  (via drill 0.35)
  Top 0.152: Q1.2 24.86,8.61 28.75,12.5 v32.5,12.5 | v34.89,10.11 34.89,10.89 41.21,17.21 IC1.35
  Bottom 0.152: v32.5,12.5 v34.89,10.11
GATE2  (via drill 0.35)
  Top 0.152: Q1.4 26.66,11.16 28.75,13.25 v33.25,13.25 | v35.5,8.96 35.5,10.91 IC1.36
  Bottom 0.152: v33.25,13.25 35.5,11 v35.5,8.96
GATE3  (via drill 0.35)
  Top 0.152: Q2.2 24.39,14.86 25.25,14 v34,14 | v36.5,8 36.5,11.21 IC1.37
  Bottom 0.152: v34,14 34,13.5 36.25,11.25 36.25,8.25 v36.5,8
GATE4  (via drill 0.35)
  Top 0.152: Q2.4 24.34,17.41 25.25,16.5 25.25,15.25 25.75,14.75 v34.75,14.75 | v37.25,9.75 37.87,9.75 IC1.41
  Bottom 0.152: v34.75,14.75 36.75,12.75 36.75,10 37,9.75 v37.25,9.75
GND  (via drill 0.35)
  Top 0.152: C7.2 C4.2 30.55,7.3 v29.75,6.5 | v22.25,8 22.25,7.95 SW1.P$1 | IC1.32 38.01,16.25 v37.5,16.25 | IC4.3 6.5,39.5 6.75,39.75 6.75,40.25 6.5,40.5 IC4.1 3.75,40.5 | 3.75,40.5 2.45,40.5 C3.2 | 3.75,40.5 3.75,40 v4,39.75 | v7,34 IC5.3 4,34 3.2,33.2 C5.2 4.2,31 v6,31 | C6.2 34.45,39.2 36,40.75 IC6.3 38.36,40.75 v39.25,39.86 | IC1.99 50.47,32.25 v50.5,32.25 52.59,32.25 57.22,27.63 57.22,26.27 IC1.81 | IC1.62 54,14.79 54,14.18 53.14,13.32 53.14,3.5 v52.2,2.56 v52.2,2.55 | IC7.5 13.76,31.69 v13.07,31 | AC1.5 AC1.4 16.9,25.9 16.5,25.5 16.5,24.75 16.95,24.3 AC1.2 18.55,24.3 18.75,24.5 18.75,29.25 18.5,29.5 v18.5,30.05 | IC1.11 42,28.91 v42,29.5
  Top 0.406: Q2.3 22.89,16.14 22.25,15.5 v22.25,14.25 22.91,13.59 Q2.1 | Q1.3 23.14,9.89 22.25,9 v22.25,8 22.91,7.34 Q1.1 | v58.75,18.25 58.75,17.25 54.25,12.75 54.25,9.75 54.71,9.29 U$3.GND | v31.25,16.5 v26.75,16.5 | U$2.6 30.57,25.46 v31,25.89 | v44,12 47.75,8.25 49.25,8.25 v50.75,6.75
  Bottom 0.152: 46.47,41.28 47.75,42.56 47.75,45.51 J1.34 50.28,45.5 55.36,45.5 J1.39 | 46.47,41.28 JP3.2 | 13.45,48.1 7.6,48.1 6.25,46.75 6.25,41.5 4.5,39.75 | 4.5,39.75 4.5,37.25 6.12,35.62 6.75,35.62 | 6.75,35.62 U$4.P$4 | v22.25,8 23.75,6.5 v29.75,6.5 | v37.5,16.25 35.9,17.85 D14.2 | J1.6 14.72,45.5 17.5,45.5 18.53,44.47 J1.9 | v4,39.75 4.5,39.75 | v7,34 7,35.38 6.75,35.62 | 46.47,41.28 46.47,37.72 45.86,37.11 45.86,34.11 | 45.86,34.11 45,34.11 v39.25,39.86 | 45.86,34.11 45.86,31.67 45.19,31 | 49.25,31 v50.5,32.25 | v18.5,30.05 18.5,31 | v42,29.5 43.69,29.5 IC3.20 | v52.2,2.55 52.2,3.7 54.75,6.25 61.03,6.25 61.89,7.11
  Bottom 0.406: D6.2 D5.2 4,26 5.5,27.5 5.5,30.5 v6,31 8,31 9.28,29.72 IC2.20 | IC2.20 12.78,29.72 14.25,28.25 14.25,19.75 12.78,18.28 IC2.11 | D8.2 31,24.4 31,19 | 31,19 32,18 D7.2 | 13,31 v13.07,31 18.5,31 23.81,31 24.6,30.22 IC2.1 | 13,31 11.72,29.72 IC2.20 | D15.2 65.5,18 64.5,19 64.5,27.5 66,29 D16.2 | IC2.1 25.7,30.81 C1.2 | C2.2 58.7,30.7 57.72,29.72 IC3.1 57.1,29.9 56,31 49.25,31 45.19,31 IC3.20 42.62,31 37.5,31 35.9,29.4 D13.2 35.9,30.45 35.25,31.1 34.3,31.1 33.65,30.45 33.65,26.35 33.3,26 D8.2 | IC2.1 25.39,30.5 29.5,30.5 30.5,29.5 30.5,26.5 31,26 | 31,26 D8.2 | J7.1 16.5,34.5 13,31 | v22.25,14.25 22.25,15.93 IC2.10 25.97,18.28 26.75,17.5 v26.75,16.5 | IC3.10 58.72,18.28 v58.75,18.25 | 31,19 31,16.75 v31.25,16.5 | v31,25.89 31,26 | v44,12 43.9,12.1 IC3.11 | v50.75,6.75 51.75,7.75 58.16,7.75 U$3.GND
  Bottom 0.508: 74.38,3.62 73,5 73,8.25 75.5,10.75 U$1.GND U$1.GND1 U$1.GND2 U$1.GND3 U$1.GND4 U$1.GND5 U$1.GND6 U$1.GND7 U$5.GND_2 U$5.GND_1 U$5.GND 75.5,42.93 5V.P$2 72.93,45.61 JP1.3 68.89,49.65 15,49.65 13.45,48.1 J1.6 | 74.38,3.62 74.5,3.5 12V.P$2 | 74.38,3.62 73.46,2.71 JP2.3 66.1,7.11 | 66.1,7.11 D15.2 | U$3.GND 61.89,7.11 66.1,7.11 | v22.25,8 v22.25,14.25 | D14.2 34.9,17 33.6,17 D7.2
MISO
  Top 0.152: U$2.1 21.21,30.54 24.75,27 36.25,27 39.09,24.16 IC1.22
MOSI
  Top 0.152: U$2.4 35.84,28 IC1.21
N$1
  Top 0.152: IC1.33 31.96,9.5 30.45,9.5 C4.1 28.95,3.39 Q3.1
N$2
  Top 0.152: IC1.34 34.21,11.04 34.21,8.16 C7.1 34.05,3.11 Q3.2
N$3
  pour Top (isolate 0.406): -5.65,53.05 -5.65,-5.5 91.6,-5.5 91.6,53.3
N$4
  pour Bottom (isolate 0.406): -5.7,-5.45 91.7,-5.45 91.7,53.3 -5.6,53.1
OUT1  (via drill 0.35)
  Top 0.406: v50.5,18.5 50,18.5 47.75,16.25 v47.75,10.5
  Bottom 0.406: D16.1 D12.2 57.19,26 IC3.4 55.91,25.91 54.25,24.25 54.25,19 53.75,18.5 v50.5,18.5 | v47.75,10.5 50.07,10.5 J2.1
OUT2  (via drill 0.35)
  Top 0.406: v60.5,18 55,12.5 v55,10.5
  Bottom 0.406: IC3.5 60.87,24.63 61.9,23.6 D11.2 D15.1 v60.5,18 | v55,10.5 53.43,10.5 J2.2
OUT_3
  Bottom 0.406: 40.19,25.91 D9.2 D13.1 | 40.19,25.91 IC3.17 | J3.1 38.5,13.57 38.5,24.5 39.91,25.91 40.19,25.91
OUT_4
  Bottom 0.406: IC3.16 41.63,24.63 40.1,23.1 D10.2 D14.1 40.1,13.97 J3.2
OUT_5
  Bottom 0.406: IC2.4 28.31,25.91 D8.1 | D8.1 D4.2 | D8.1 30,24.4 30,8.5 29,7.5 26.5,7.5 25,9 J4.1
OUT_6
  Bottom 0.406: IC2.5 26.86,24.63 28.5,23 28.4,22.9 D3.2 D7.1 28.4,10.47 J4.2
OUT_7
  Bottom 0.406: J5.1 7.43,13.07 5,15.5 5,23.9 D5.1 | D5.1 D1.2 | D5.1 11.31,26 IC2.17
OUT_8
  Bottom 0.406: J5.2 14.5,14 12.5,16 9.1,16 D2.2 D6.1 7.1,23.6 8.14,24.63 IC2.16
PI_RX  (via drill 0.35)
  Top 0.152: IC1.3 45.73,30.77 v43.25,33.25
  Bottom 0.152: J1.21 33.77,40.98 41.5,33.25 v43.25,33.25
PI_TX  (via drill 0.35)
  Top 0.152: v44.75,32.75 44.75,32.53 IC1.2
  Bottom 0.152: J1.19 31.23,42.27 41.25,32.25 44.25,32.25 v44.75,32.75
PWM2
  Top 0.152: U$1.8 69.25,31.63 69.25,34.25 68,35.5 54.5,35.5 53.75,34.75 50.5,34.75 49,36.25 40.25,36.25 39.5,35.5 39.5,34.95 IC1.6
PWM3
  Top 0.152: U$5.3 68.38,36 54.25,36 53.5,35.25 50.75,35.25 49.25,36.75 40,36.75 39,35.75 39,34.74 IC1.7
PWM4  (via drill 0.35)
  Top 0.152: IC1.1 46.51,32.26 v46.8,32.55
  Bottom 0.152: v46.8,32.55 46.8,32.98 U$3.IN
PWM5
  Top 0.152: U$1.7 68.75,29.59 68.75,34 67.75,35 54.75,35 54,34.25 50.25,34.25 48.75,35.75 40.75,35.75 40.25,35.25 40.25,34.91 IC1.5
PWM6
  Top 0.152: IC1.15 37.25,30.84 37.25,34.75 39.75,37.25 49.75,37.25 51.25,35.75 53,35.75 53.75,36.5 U$5.2
PWM7  (via drill 0.35)
  Top 0.152: v54.98,21.73 53.35,23.36 46.75,23.36 44.61,25.5 41.88,25.5 IC1.16 36.75,30.63 36.75,35.25 39.25,37.75 50,37.75 51.5,36.25 52.75,36.25 53.54,37.04 68.42,37.04 U$5.1
  Bottom 0.152: IC3.8 55.89,20.83 v54.98,21.73
PWM8  (via drill 0.35)
  Top 0.152: IC1.17 42.25,24.42 v42.25,23.75
  Bottom 0.152: v42.25,23.75 42.25,22.99 43.15,22.09 IC3.14
PWM9  (via drill 0.35)
  Top 0.152: IC1.18 36.11,29.85 v34.8,29.85 | v34,22.5 32.25,20.75 v26.5,20.75
  Bottom 0.152: v34,22.5 34.15,22.65 34.15,29.2 v34.8,29.85 | v26.5,20.75 24.67,20.75 IC2.8
PWM10  (via drill 0.35)
  Top 0.152: IC1.23 37.93,24.5 23.75,24.5 21,21.75 v9.25,21.75
  Bottom 0.152: v9.25,21.75 11.06,21.75 IC2.14
PWM11  (via drill 0.35)
  Top 0.152: U$1.6 64.04,19 v59.5,19 | v48,18 47,19 42.72,19 42.5,19.22 42.5,19.75 v42,20.25 | v41.42,23.38 40.79,22.75 38.97,22.75 IC1.24
  Bottom 0.152: v59.5,19 59.5,18 58.75,17.25 48.75,17.25 v48,18 | v42,20.25 42,22.8 v41.42,23.38
PWM12  (via drill 0.35)
  Top 0.152: U$1.5 64.08,16.5 v60.5,16.5 | v46.75,18 46.5,18.25 42.75,18.25 41.8,19.2 v41.8,19.3 | IC1.25 38.03,22.97 38.6,22.4 v41.35,22.4
  Bottom 0.152: v60.5,16.5 48.25,16.5 v46.75,18 | v41.8,19.3 41.35,19.76 v41.35,22.4
PWM13  (via drill 0.35)
  Top 0.152: U$1.4 65.87,15.75 v64,15.75 | v46.75,17 46,17.75 42.5,17.75 39.23,21.02 38.54,21.02 IC1.26
  Bottom 0.152: v64,15.75 48,15.75 v46.75,17
PWM44  (via drill 0.35)
  Top 0.152: IC1.40 43.66,16.25 44.5,16.25 v46.75,14 | v64,12.75 70.35,12.75 U$1.1
  Bottom 0.152: v46.75,14 48,12.75 v64,12.75
PWM45  (via drill 0.35)
  Top 0.152: IC1.39 43.46,16.75 45,16.75 v46.75,15 | v64,13.75 68.95,13.75 U$1.2
  Bottom 0.152: v46.75,15 48,13.75 v64,13.75
PWM46  (via drill 0.35)
  Top 0.152: IC1.38 43.25,17.25 45.5,17.25 v46.75,16 | v64,14.75 67.41,14.75 U$1.3
  Bottom 0.152: v46.75,16 48,14.75 v64,14.75
RESET  (via drill 0.35)
  Top 0.152: SW1.P$2 23.95,5.25 27,8.3 27,9.25 28.5,10.75 R1.2 29.9,11.75 32.75,11.75 36.25,15.25 36.25,16.75 | IC1.30 37.84,17.5 37,17.5 36.25,16.75 | 36.25,16.75 35,15.5 26.25,15.5 25.75,16 25.75,17.5 24.25,19 v21.75,19 | v21.75,24.25 20.96,25.04 U$2.5
  Bottom 0.152: v21.75,19 v21.75,24.25
SCK  (via drill 0.35)
  Top 0.152: U$2.3 23.25,28 24.75,26.5 34.55,26.5 v34.8,26.25 | v34.8,28.75 35.8,28.75 IC1.20
  Bottom 0.152: v34.8,28.75 v34.8,26.25
SCL  (via drill 0.35)
  Top 0.152: v9.75,41.25 9.95,41.05 IC4.10 | v8.45,37.2 9.95,35.69 IC5.10 | J1.5 15.93,41.75 IC6.1 IC6.10 | v8.45,37.2 8.87,37.2 11.31,37.2 v11.75,36.75 | v8.45,37.2 7.75,36.5 7.75,31.5 13.25,26 13.25,24.25 14.75,22.75 16.25,22.75 16.5,23 AC1.14
  Bottom 0.152: v9.75,41.25 9.75,45.25 10,45.5 11.43,45.5 12.7,44.23 J1.5 13.45,42.4 R3.1 13.85,41.35 13.25,40.75 13.25,37 13,36.75 v11.75,36.75 | U$4.P$2 7.52,38.12 v8.45,37.2
SDA  (via drill 0.35)
  Top 0.152: v10.91,42.75 10.91,40.16 10.75,40 IC4.9 | IC5.9 9,34.5 v8.5,35 8.25,34.75 8.25,31.75 13.75,26.25 13.75,24.25 14.5,23.5 AC1.13 | J1.3 14.14,41 v29,41 | v30.5,42.5 42.25,42.5 42.5,42.25 42.5,41.5 42.25,41.25 IC6.9
  Bottom 0.152: J1.3 v10.91,42.75 | R2.1 10.91,42.44 v10.91,42.75 | v10.91,42.75 10.66,42.5 10.66,35.66 10.12,35.12 8.5,35.12 | U$4.P$3 7.4,36.38 8.88,36.38 8.5,36 8.5,35.12 | 8.5,35.12 v8.5,35 | v29,41 v30.5,42.5
TMP1
  Top 0.152: IC5.7 22.12,33.5 J7.7
TMP2
  Top 0.152: IC5.6 24.16,33 J7.9
TMP3  (via drill 0.35)
  Top 0.152: IC5.5 5.55,32.7 v6.25,32 | v10.25,30.75 IC7.2
  Bottom 0.152: v6.25,32 6.5,31.75 8.5,31.75 9.5,30.75 v10.25,30.75

### Text on the board
tPlace: URI HYDROBOTICS 2019 | GND | +5V | PWR_MONITOR | SVO1 | SVO2 | SVO3 | 12V | PWM1 | PWM2 | PWM3 | 12V | ICSP | PWM4 | D4 | PWM5 | PWM6 | D3 | PWM7 | D2 | PWM8 | D1 | +12V | GND
bPlace: FDBR